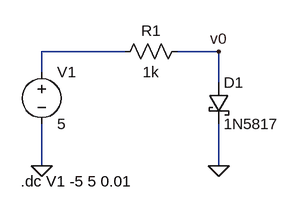
[diagram p0: schematic 1N5817.asc]
1N5817.asc, the LTspice schematic file:
Version 4
SHEET 1 880 680
WIRE 160 80 32 80
WIRE 304 80 240 80
WIRE 32 112 32 80
WIRE 304 128 304 80
WIRE 32 256 32 192
WIRE 304 256 304 192
FLAG 304 256 0
FLAG 304 80 v0
FLAG 32 256 0
SYMBOL res 256 64 R90
WINDOW 0 0 56 VBottom 2
WINDOW 3 32 56 VTop 2
SYMATTR InstName R1
SYMATTR Value 1k
SYMBOL schottky 288 128 R0
SYMATTR InstName D1
SYMATTR Value 1N5817
SYMATTR Description Diode
SYMATTR Type diode
SYMBOL voltage 32 96 R0
WINDOW 123 0 0 Left 0
WINDOW 39 0 0 Left 0
SYMATTR InstName V1
SYMATTR Value 5
TEXT 0 280 Left 2 !.dc V1 -5 5 0.01

The netlist it stands for:
* 1N5817.asc
R1 v0 N001 1k
D1 v0 0 1N5817
V1 N001 0 5
.model D D
.lib standard.dio
.dc V1 -5 5 0.01
.backanno
.end

* Results of the author's LTspice run, read from the files saved beside the schematic
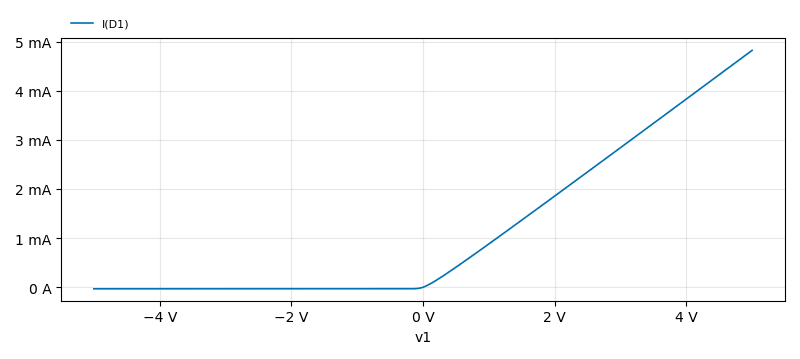
[diagram p1: DC transfer characteristic of 1N5817.asc, plotted from the saved traces]
* DC transfer characteristic, 1 run:
*   I(D1): -31.7 µA at v1=-5 V, 4.821 mA at v1=5 V, min -31.7 µA, max 4.821 mA